# EAGLE design Tetris (EAGLE 6.5.0)
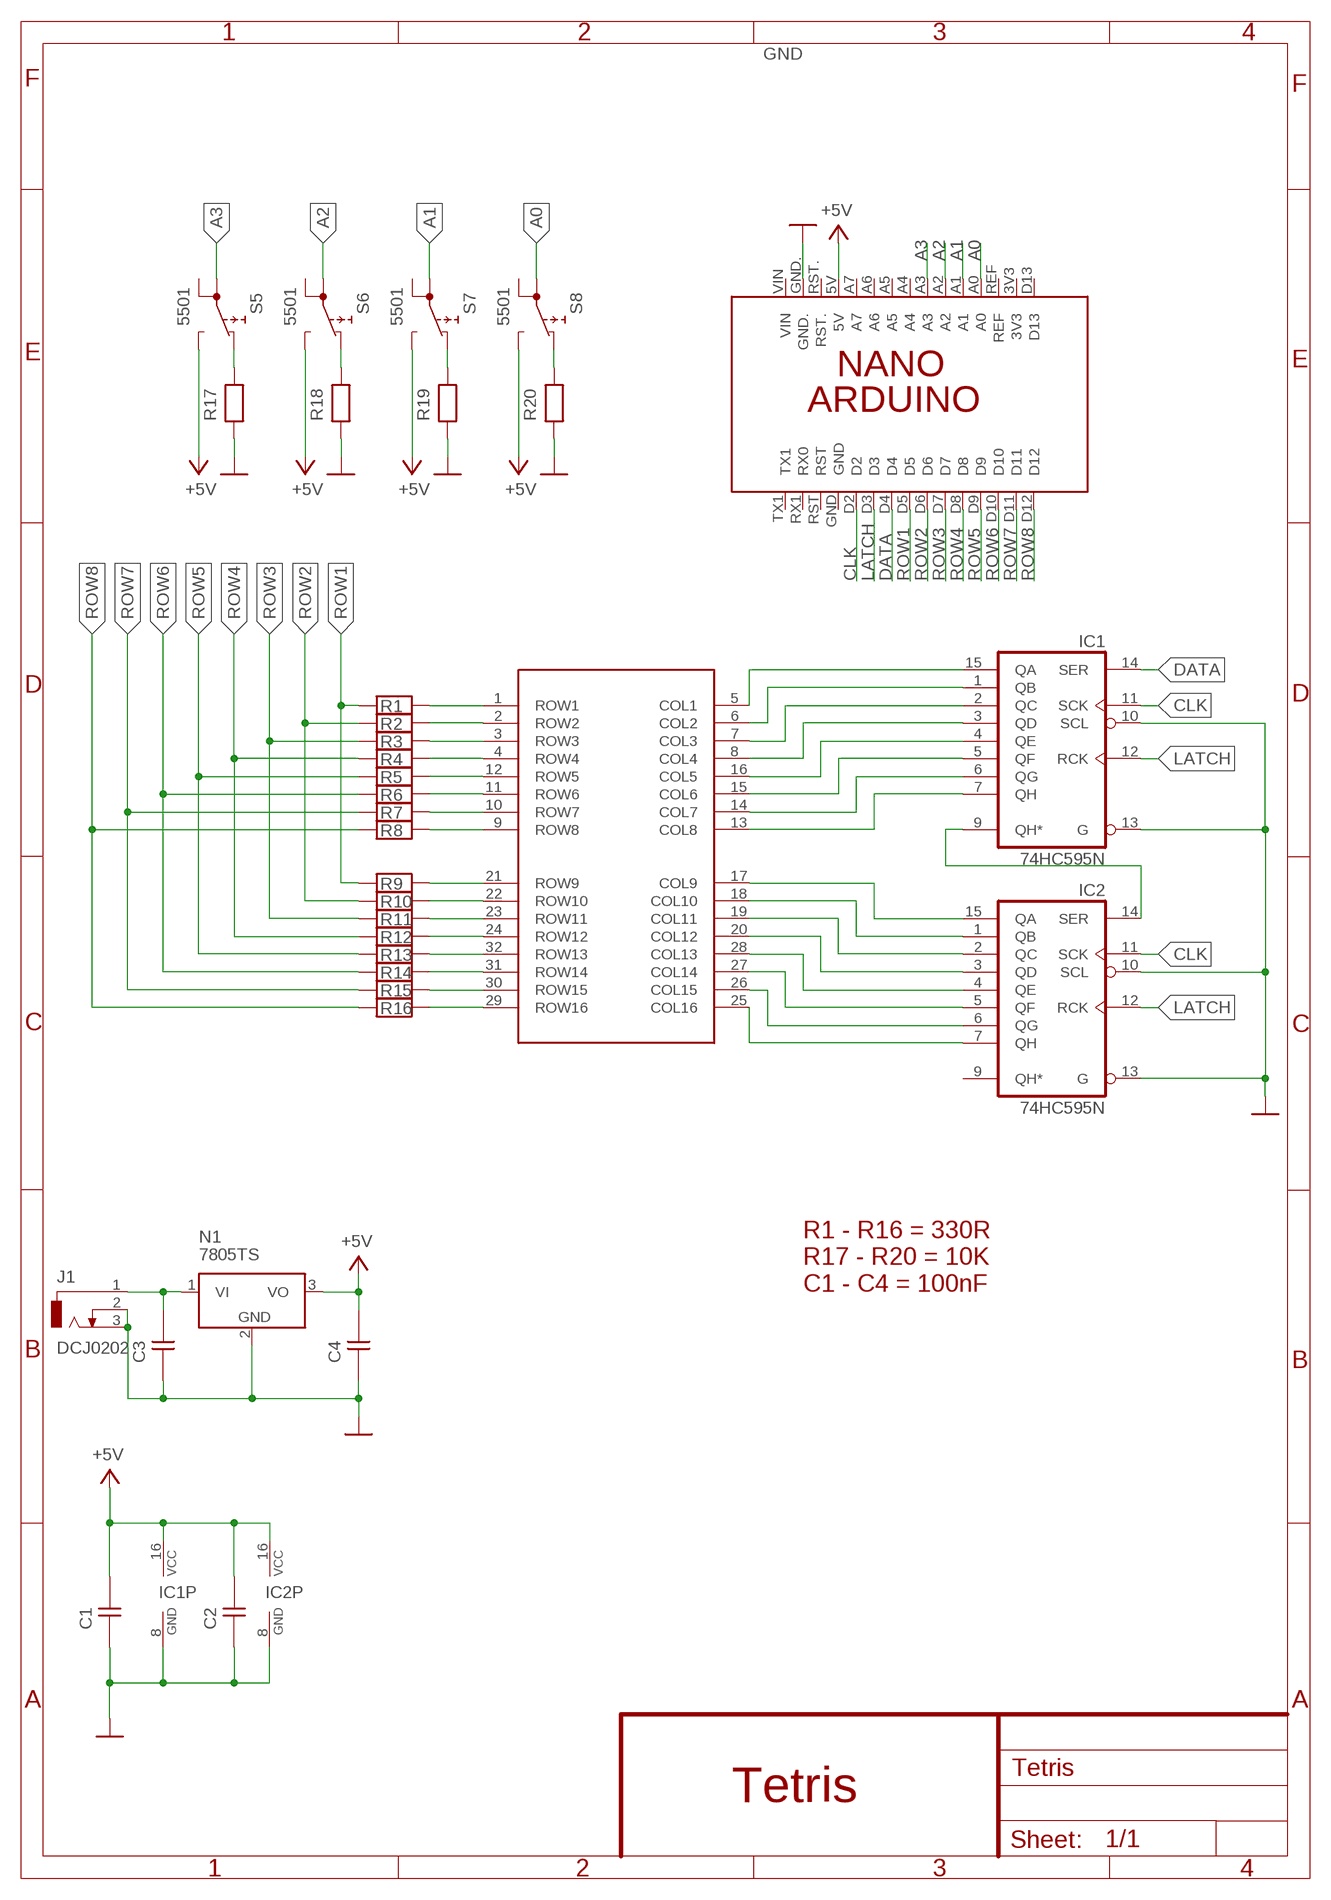
[diagram p0: schematic, sheet 1]

## Parts
C1  C-7.5  [C-7,5]
C2  C-7.5  [C-7,5]
C3  C-7.5  [C-7,5]
C4  C-7.5  [C-7,5]
IC1  74HC595N  [DIL16]
IC2  74HC595N  [DIL16]
J1  DCJ0202  [DCJ0202]
N1  7805TS  [TO-220S]
PCB1  ARDUINO_NANO  [ARDUINO_NANO]
R1  R-10  [R-10]
R2  R-10  [R-10]
R3  R-10  [R-10]
R4  R-10  [R-10]
R5  R-10  [R-10]
R6  R-10  [R-10]
R7  R-10  [R-10]
R8  R-10  [R-10]
R9  R-10  [R-10]
R10  R-10  [R-10]
R11  R-10  [R-10]
R12  R-10  [R-10]
R13  R-10  [R-10]
R14  R-10  [R-10]
R15  R-10  [R-10]
R16  R-10  [R-10]
R17  R-10  [R-10]
R18  R-10  [R-10]
R19  R-10  [R-10]
R20  R-10  [R-10]
S5  5501  [5501]
S6  5501  [5501]
S7  5501  [5501]
S8  5501  [5501]
U$9  DOT_MATRIX  [SH]

## Nets
+5V: C1.2 C2.2 C4.2 IC1.16(VCC) IC2.16(VCC) N1.3(VO) PCB1.5V S5.NC(NO) S6.NC(NO) S7.NC(NO) S8.NC(NO)
A0: PCB1.A0 S8.1A
A1: PCB1.A1 S7.1A
A2: PCB1.A2 S6.1A
A3: PCB1.A3 S5.1A
CLK: IC1.11(SCK) IC2.11(SCK) PCB1.D2
DATA: IC1.14(SER) PCB1.D4
GND: C1.1 C2.1 C3.1 C4.1 IC1.8(GND) IC1.10(SCL) IC1.13(G) IC2.8(GND) IC2.10(SCL) IC2.13(G) J1.2 J1.3 N1.2(GND) PCB1.GND. R17.1 R18.1 R19.1 R20.1
LATCH: IC1.12(RCK) IC2.12(RCK) PCB1.D3
N$1: IC2.15(QA) U$9.17(COL9)
N$2: IC2.1(QB) U$9.18(COL10)
N$3: IC2.2(QC) U$9.19(COL11)
N$4: IC1.9(QH*) IC2.14(SER)
N$5: C3.2 J1.1 N1.1(VI)
N$6: IC2.3(QD) U$9.20(COL12)
N$7: IC2.4(QE) U$9.28(COL13)
N$8: IC2.5(QF) U$9.27(COL14)
N$9: IC2.6(QG) U$9.26(COL15)
N$10: IC2.7(QH) U$9.25(COL16)
N$11: IC1.7(QH) U$9.13(COL8)
N$12: IC1.6(QG) U$9.14(COL7)
N$13: IC1.5(QF) U$9.15(COL6)
N$14: IC1.4(QE) U$9.16(COL5)
N$15: IC1.3(QD) U$9.8(COL4)
N$16: IC1.2(QC) U$9.7(COL3)
N$17: IC1.1(QB) U$9.6(COL2)
N$18: IC1.15(QA) U$9.5(COL1)
N$19: R8.2 U$9.9(ROW8)
N$20: R7.2 U$9.10(ROW7)
N$21: R6.2 U$9.11(ROW6)
N$22: R5.2 U$9.12(ROW5)
N$23: R1.2 U$9.1(ROW1)
N$24: R2.2 U$9.2(ROW2)
N$25: R3.2 U$9.3(ROW3)
N$26: R4.2 U$9.4(ROW4)
N$27: R9.2 U$9.21(ROW9)
N$28: R10.2 U$9.22(ROW10)
N$29: R11.2 U$9.23(ROW11)
N$30: R12.2 U$9.24(ROW12)
N$31: R13.2 U$9.32(ROW13)
N$32: R14.2 U$9.31(ROW14)
N$33: R15.2 U$9.30(ROW15)
N$34: R16.2 U$9.29(ROW16)
N$37: R17.2 S5.NO(NC)
N$38: R18.2 S6.NO(NC)
N$39: R19.2 S7.NO(NC)
N$40: R20.2 S8.NO(NC)
ROW1: PCB1.D5 R1.1 R9.1
ROW2: PCB1.D6 R2.1 R10.1
ROW3: PCB1.D7 R3.1 R11.1
ROW4: PCB1.D8 R4.1 R12.1
ROW5: PCB1.D9 R5.1 R13.1
ROW6: PCB1.D10 R6.1 R14.1
ROW7: PCB1.D11 R7.1 R15.1
ROW8: PCB1.D12 R8.1 R16.1
Unconnected: IC2.9(QH*) PCB1.3V3 PCB1.A4 PCB1.A5 PCB1.A6 PCB1.A7 PCB1.D13 PCB1.GND PCB1.REF PCB1.RST PCB1.RST. PCB1.RX1(RX0) PCB1.TX1 PCB1.VIN S5.1B S6.1B S7.1B S8.1B

## Notes on the sheet
- R1 - R16 = 330R
  R17 - R20 = 10K
  C1 - C4 = 100nF
- Tetris

## Library data of the parts
C1-C4 = rcl:C: CAPACITOR
IC1 IC2 = 74xx-eu:74*595: 8-bit SHIFT REGISTER, output latch
J1 = con-jack:DCJ0202: DC POWER JACK Source: DCJ0202.pdf; OC_FARNELL: unknown; OC_NEWARK: unknown
N1 = linear:78*: Positive VOLTAGE REGULATOR
PCB1 = Arduino:ARDUINO_NANO: Device for representing an Arduino Nano board with a footprint in an EAGLE design. Created by Dave Young for Element14. More EAGLE documentation at: http://www.element14.com/community/community/knode/cadsoft_eagle
R1-R20 = rcl:R: RESISTOR
S5-S8 = switch:55?: PUSHBUTTON SERIES 5500 SWITCHES Source: www.e-switch.com .. 5500.pdf
U$9 = ledMatrix:DOT_MATRIX

## Board
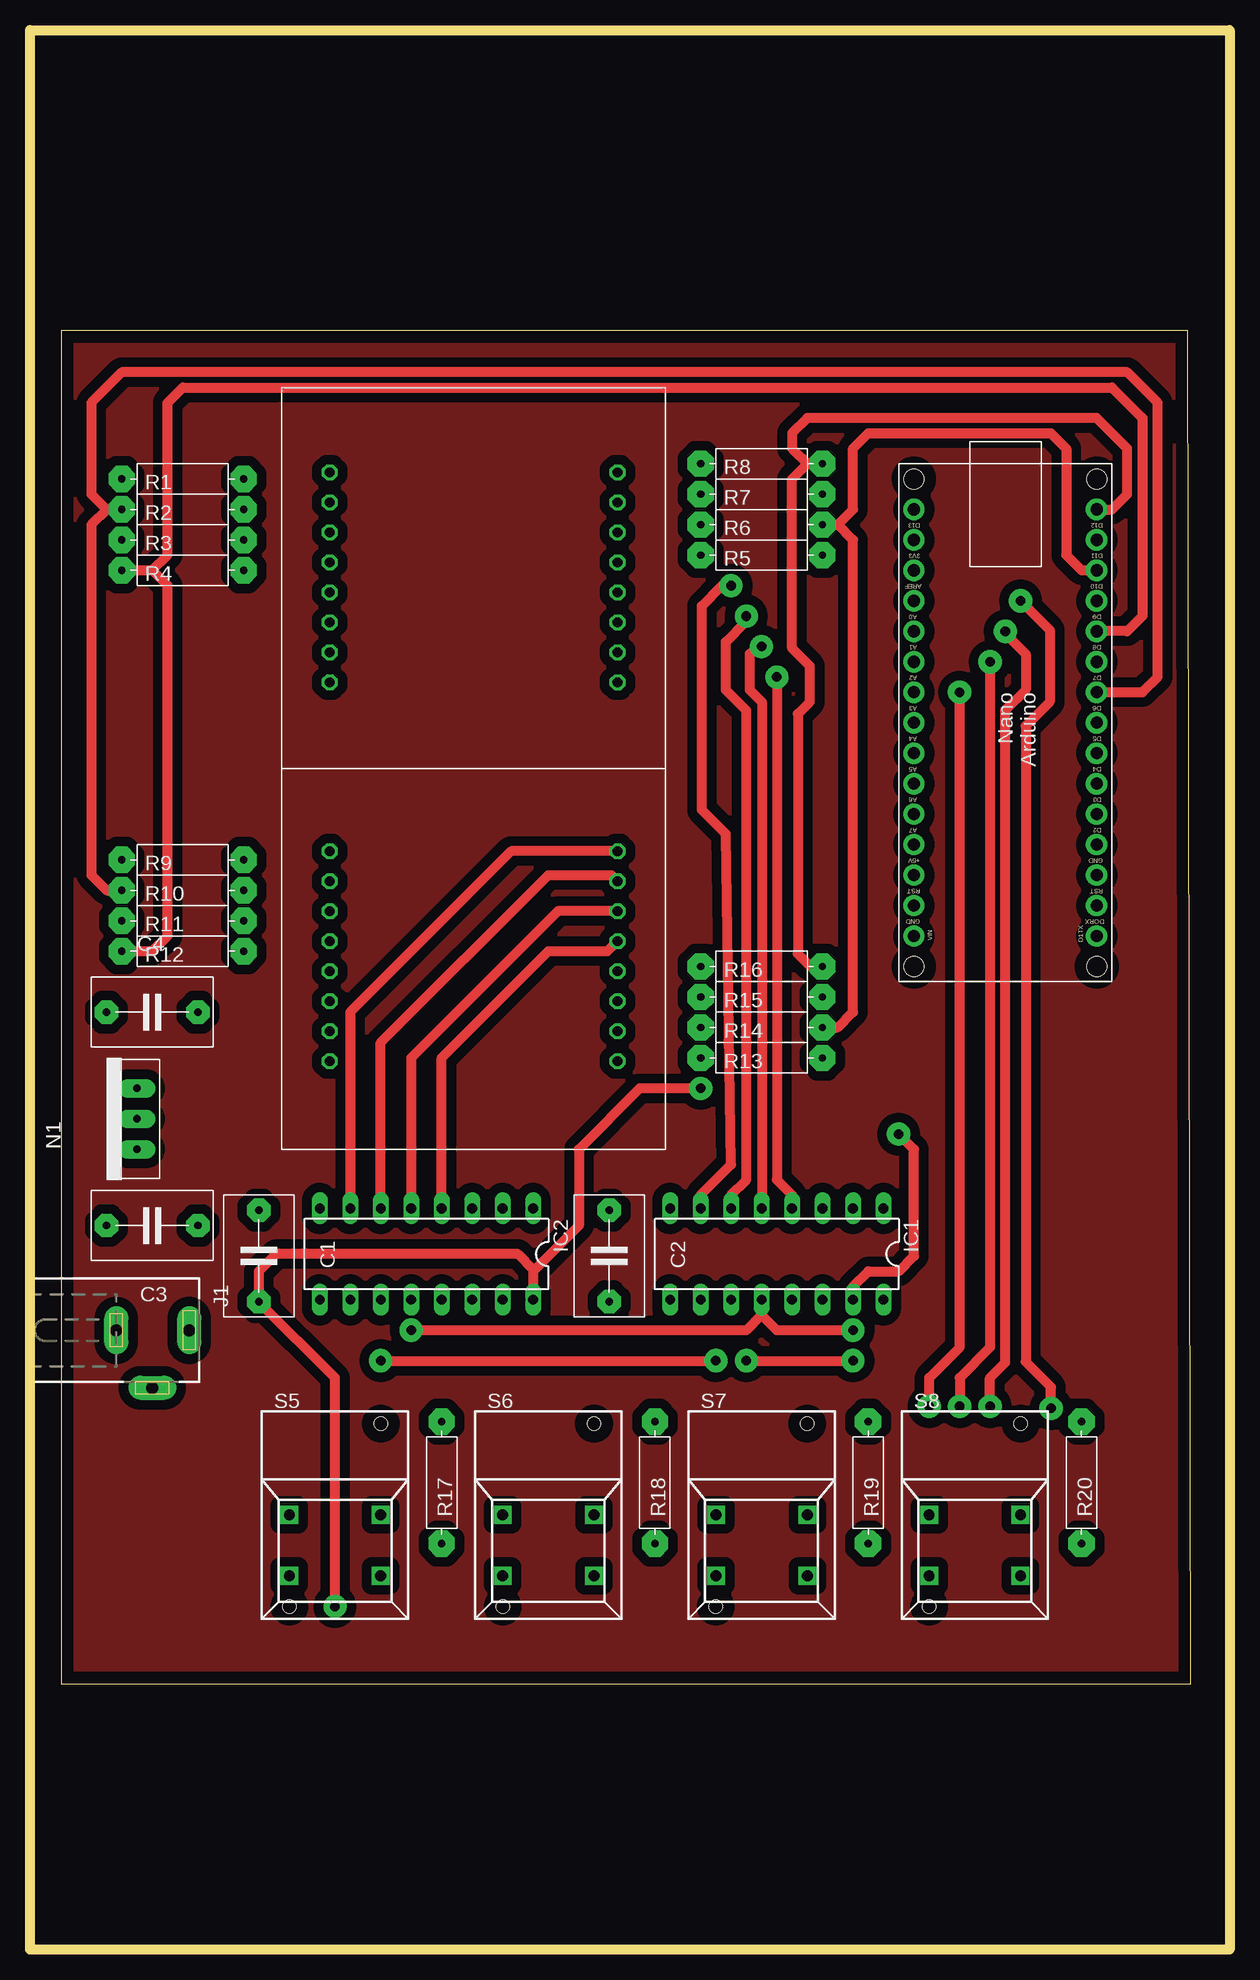
[diagram p1: board, top side]
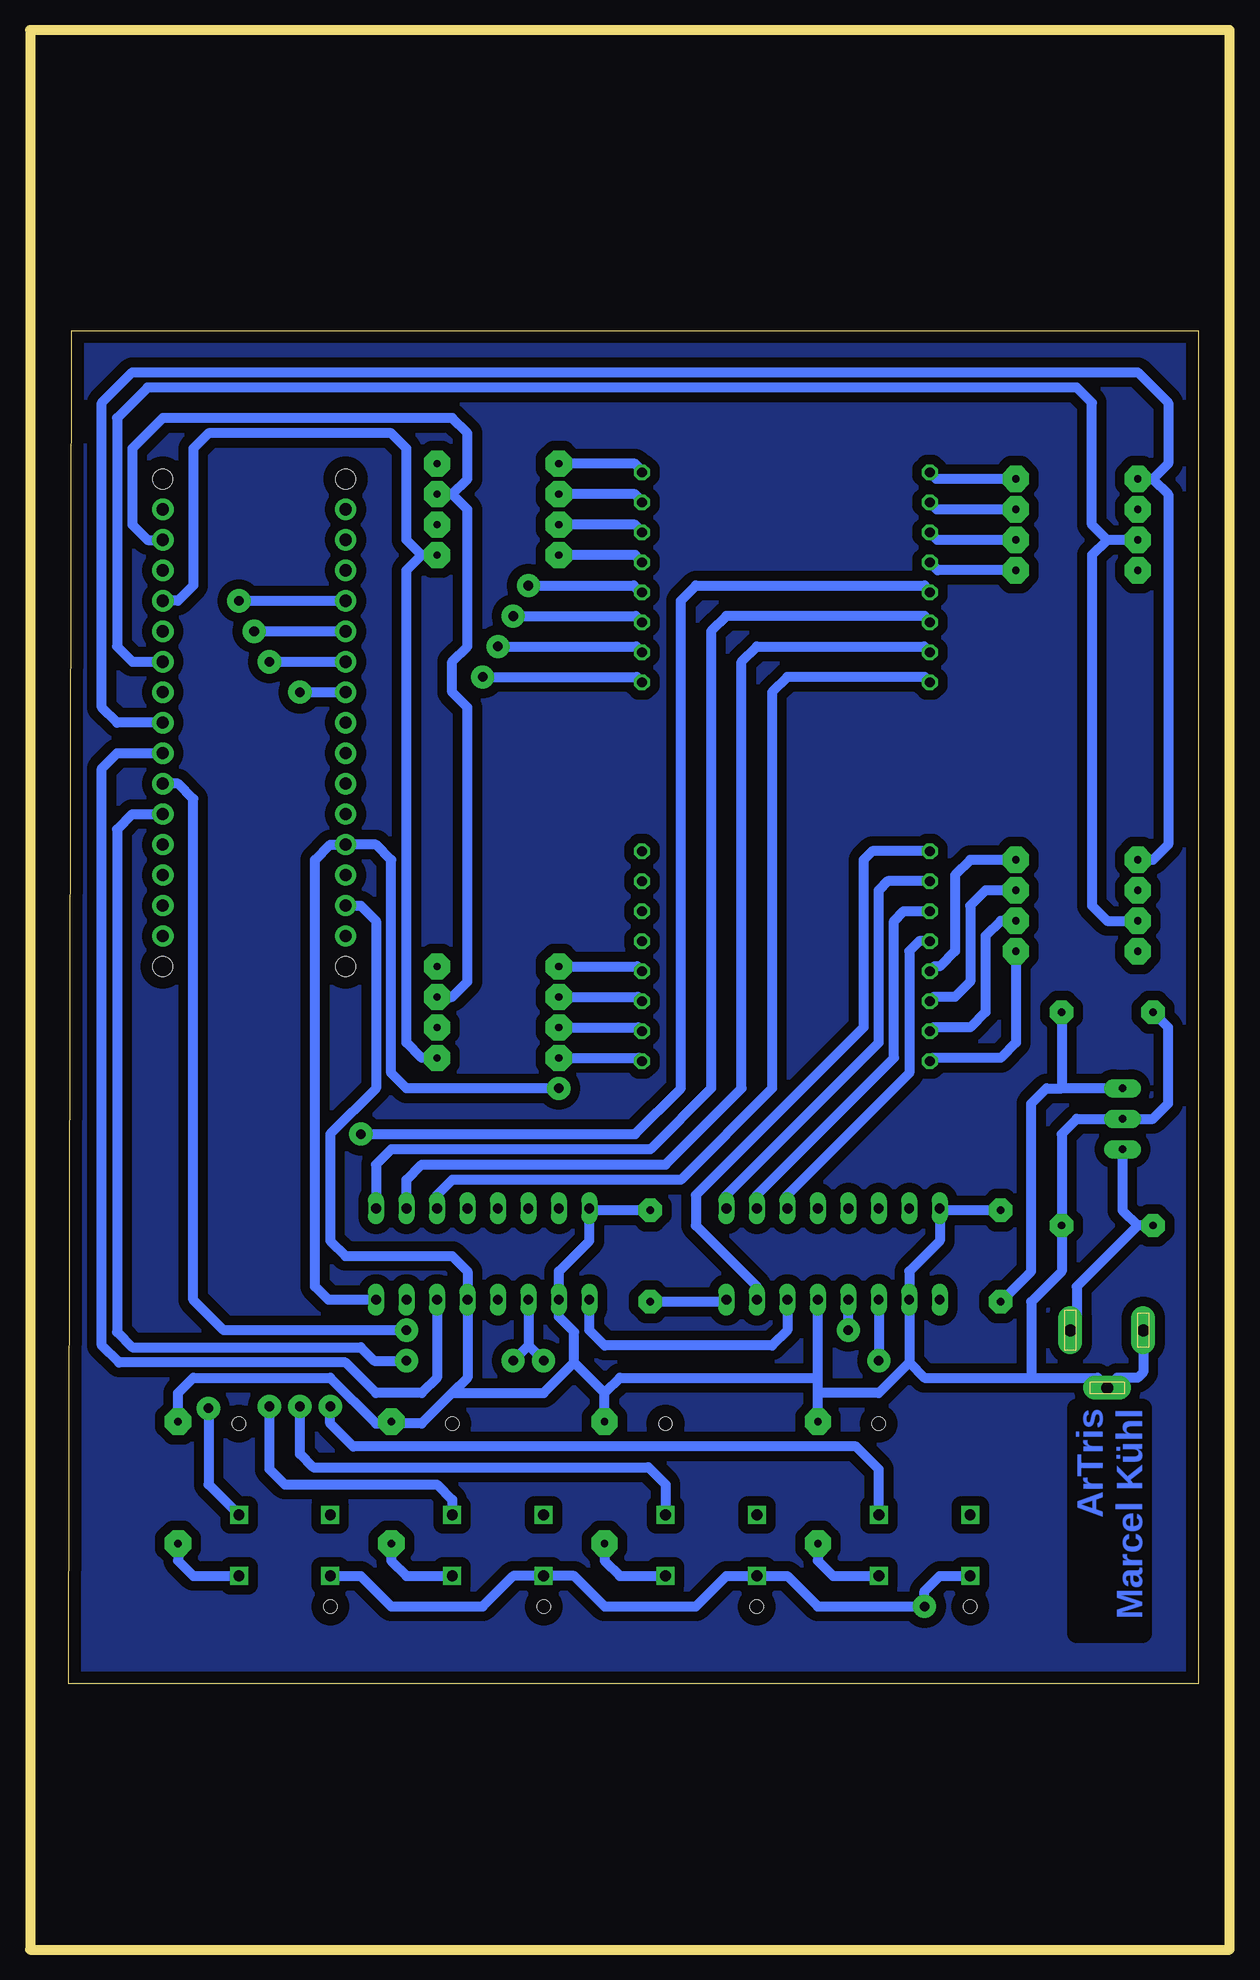
[diagram p2: board, bottom side, seen from below]

Size 100 x 160 mm. Coordinates in mm from the lower left corner, seen from the top.
Outline: 2.61,22.14 96.78,22.14 96.53,134.95 2.62,134.95 2.61,22.14
Outline: 0,0 0,160 100,160 100,0 0,0
Copper layers (1*16): Top 0.035mm / dielectric 1.5mm / Bottom 0.035mm
Design rules "default *": minimum track width 10mil, minimum drill 24mil, track to track 8mil, track to pad 8mil, pad to pad 8mil, via to via 8mil, smd to smd 8mil, copper to edge 40mil, drill to drill 8mil, minimum pad ring 10mil, minimum via ring 8mil, stop-mask expansion 4mil, vias tented up to drill 0mil, thermal gap 10mil

### Footprints (pad centres in the part's own frame; a part is rotated, then mirrored left to right if it is on the bottom)
C-7,5 = drill 0.61 pad 1.93 octagon: 1 -3.81,0; 2 3.81,0
DIL16 = drill 0.813 long: 1 -8.89,-3.81; 2 -6.35,-3.81; 3 -3.81,-3.81; 4 -1.27,-3.81; 5 1.27,-3.81; 6 3.81,-3.81; 7 6.35,-3.81; 8 8.89,-3.81; 9 8.89,3.81; 10 6.35,3.81; 11 3.81,3.81; 12 1.27,3.81; 13 -1.27,3.81; 14 -3.81,3.81; 15 -6.35,3.81; 16 -8.89,3.81
DCJ0202 = drill 1 pad 2 long: 1 0,3.1; 2 4.8,0; 3 0,-3
TO-220S = drill 0.61 pad 1.524 long: 1 -2.54,0; 2 0,0; 3 2.54,0
ARDUINO_NANO = drill 1.016 pad 1.778: 3V3 6.35,1.27; 5V 31.75,1.27; A0 11.43,1.27; A1 13.97,1.27; A2 16.51,1.27; A3 19.05,1.27; A4 21.59,1.27; A5 24.13,1.27; A6 26.67,1.27; A7 29.21,1.27; D2 29.21,16.51; D3 26.67,16.51; D4 24.13,16.51; D5 21.59,16.51; D6 19.05,16.51; D7 16.51,16.51; D8 13.97,16.51; D9 11.43,16.51; D10 8.89,16.51; D11 6.35,16.51; D12 3.81,16.51; D13 3.81,1.27; GND 31.75,16.51; GND. 36.83,1.27; REF 8.89,1.27; RST 34.29,16.51; RST. 34.29,1.27; RX1 36.83,16.51; TX1 39.37,16.51; VIN 39.37,1.27 | hole 1.651: 1.27,1.27; 1.27,16.51; 41.91,16.51; 41.91,1.27
R-10 = drill 0.61 pad 2.184 octagon: 1 -5.08,0; 2 5.08,0
5501 = drill 0.9 pad 1.5 square: 1A 0,3.81; 1B 0,-3.81; NC 5.08,-3.81; NO 5.08,3.81 | hole 1.1: -7.62,3.81; 7.62,-3.81
SH = drill 0.8 octagon: 1 4,-7.07; 2 4,-9.57; 3 4,-12.07; 4 4,-14.57; 5 4,-17.07; 6 4,-19.57; 7 4,-22.07; 8 4,-24.57; 9 28,-7.07; 10 28,-9.57; 11 28,-12.07; 12 28,-14.57; 13 28,-17.07; 14 28,-19.57; 15 28,-22.07; 16 28,-24.57; 17 4,-38.64; 18 4,-41.14; 19 4,-43.64; 20 4,-46.14; 21 4,-48.64; 22 4,-51.14; 23 4,-53.64; 24 4,-56.14; 25 28,-38.64; 26 28,-41.14; 27 28,-43.64; 28 28,-46.14; 29 28,-48.64; 30 28,-51.14; 31 28,-53.64; 32 28,-56.14

### Placement (x,y rotation side)
C1  19.08,57.81 270 top
C2  48.29,57.81 270 top
C3  10.19,60.35 180 top
C4  10.19,78.13 0 top
IC1  62.26,57.97 180 top
IC2  33.05,57.97 180 top
J1  10.19,51.62 270 top
N1  8.92,69.24 90 top
PCB1  72.42,123.85 270 top
R1  12.73,122.58 0 top
R2  12.73,120.04 0 top
R3  12.73,117.5 0 top
R4  12.73,114.96 0 top
R5  60.99,116.23 180 top
R6  60.99,118.77 180 top
R7  60.99,121.31 180 top
R8  60.99,123.85 180 top
R9  12.73,90.83 0 top
R10  12.73,88.29 0 top
R11  12.73,85.75 0 top
R12  12.73,83.21 0 top
R13  60.99,74.32 180 top
R14  60.99,76.86 180 top
R15  60.99,79.4 180 top
R16  60.99,81.94 180 top
R17  34.32,38.92 270 top
R18  52.1,38.92 270 top
R19  69.88,38.92 270 top
R20  87.66,38.92 270 top
S5  25.43,36.22 270 top
S6  43.21,36.22 270 top
S7  60.99,36.22 270 top
S8  78.77,36.22 270 top
U$9  20.98,130.19 0 top

### Tracks (layer width: path | path; a pad name or v marks a point on that pad's centre or on a via)
+5V  (via drill 0.8 pad 1.93)
  Top 0.813: 41.94,56.54 41.94,56.7 40.67,57.97 20.51,57.97 19.08,56.54 C1.2 25.43,47.65 v25.43,28.6 | 41.94,56.54 IC2.16 | v55.91,71.78 50.83,71.78 45.75,66.7 45.75,60.35 41.94,56.54
  Bottom 0.813: IC2.16 41.94,54 C2.2 | IC1.16 75.12,54.16 76.23,55.27 76.23,90.83 74.96,92.1 PCB1.5V 71.15,92.1 69.88,90.83 69.88,73.05 68.61,71.78 v55.91,71.78 | N1.3 14,71.78 | C4.2 14,71.78 | 14,71.78 15.27,71.78 16.54,70.51 16.54,56.54 C1.2 | S8.NC 72.42,31.14 69.88,28.6 62.26,28.6 59.72,31.14 S7.NC 54.64,31.14 52.1,28.6 44.48,28.6 41.94,31.14 S6.NC 36.86,31.14 34.32,28.6 v25.43,28.6 25.43,29.87 24.16,31.14 S5.NC
A0  (via drill 0.8 pad 1.93)
  Top 0.813: v85.12,45.11 85.12,46.88 83,49 83,102 85,104 85,110 v82.58,112.42
  Bottom 0.813: v82.58,112.42 PCB1.A0 | v85.12,45.11 85.12,38.76 S8.1A
A1  (via drill 0.8 pad 1.93)
  Top 0.813: v80.04,45.27 80.04,47.65 81.31,48.92 81.31,103.31 83,105 83,108 81.31,109.69 v81.31,109.88
  Bottom 0.813: v81.31,109.88 PCB1.A1 | v80.04,45.27 80.04,40.03 78.77,38.76 66.07,38.76 64.8,37.49 S7.1A
A2  (via drill 0.8 pad 1.93)
  Top 0.813: v80.04,107.34 80.04,50.19 77.5,47.65 v77.5,45.27
  Bottom 0.813: v80.04,107.34 PCB1.A2 | v77.5,45.27 77.5,41.3 76.39,40.19 48.45,40.19 47.02,38.76 S6.1A
A3  (via drill 0.8 pad 1.93)
  Top 0.813: v74.96,45.27 74.96,47.65 77.5,50.19 v77.5,104.8
  Bottom 0.813: v77.5,104.8 PCB1.A3 | v74.96,45.27 74.96,43.84 73.06,41.94 31.14,41.94 29.24,40.03 S5.1A
CLK  (via drill 0.8 pad 1.93)
  Top 0.813: v29.24,49.08 v57.18,49.08 | v59.72,49.08 v68.61,49.08
  Bottom 0.813: v57.18,49.08 58.45,50.35 | IC2.11 v29.24,49.08 | IC1.11 58.45,50.35 | 58.45,50.35 v59.72,49.08 | v68.61,49.08 71.31,49.08 72.42,50.19 91.47,50.19 92.74,51.46 92.74,93.37 91.47,94.64 PCB1.D2
DATA
  Bottom 0.813: PCB1.D4 92.74,99.72 94.01,98.45 94.01,50.35 92.58,48.92 73.69,48.92 71.15,46.38 67.34,46.38 66.07,47.65 IC1.14
GND
  Bottom 0.813: PCB1.GND. 72.42,87.02 71.15,85.75 71.15,71.78 74.96,67.97 74.96,59.08 73.69,57.81 64.8,57.81 63.53,56.54 IC1.13 63.53,47.65 64.8,46.38 | 34.32,47.65 IC2.13 | 26.7,48.92 IC2.10 26.7,56.54 24.16,59.08 IC2.8 24,61.62 C1.1 | 26.7,48.92 29.24,46.38 34.32,46.38 | 26.7,48.92 25.43,47.65 16.54,47.65 | 16.54,47.65 11.02,47.65 J1.2 9.36,47.65 7.65,47.65 7.19,48.11 J1.3 | 34.32,47.65 50.83,47.65 52.1,46.38 | 54.64,48.92 54.64,51.46 55.91,52.73 IC1.10 55.91,56.54 53.37,59.08 IC1.8 53.21,61.62 C2.1 | 64.8,46.38 57.18,46.38 54.64,48.92 | R20.1 87.66,46.38 86.39,47.65 74.96,47.65 71.15,43.84 69.88,43.84 | 16.54,47.65 16.54,54 14,56.54 C3.1 14,67.97 12.73,69.24 N1.2 6.38,69.24 5.11,70.51 5.11,76.86 C4.1 | R17.1 34.32,46.38 | 34.32,46.38 34.32,47.65 | R18.1 52.1,46.38 | 52.1,46.38 54.64,48.92 | 64.8,46.38 67.34,43.84 69.88,43.84 | 69.88,43.84 R19.1
LATCH  (via drill 0.8 pad 1.93)
  Top 0.813: v68.61,51.62 62.26,51.62 60.99,52.89 | IC1.12 60.99,52.89 | 60.99,52.89 59.72,51.62 v31.78,51.62
  Bottom 0.813: v31.78,51.62 IC2.12 | v68.61,51.62 83.85,51.62 86.39,54.16 86.39,95.91 87.66,97.18 PCB1.D3
N$1
  Bottom 0.813: U$9.17 29.79,91.55 30.51,90.83 30.51,76.86 44.48,62.89 44.48,60.35 39.4,55.27 IC2.15
N$2
  Bottom 0.813: IC2.1 41.94,62.89 29.24,75.59 29.24,88.29 28.48,89.05 U$9.18
N$3
  Bottom 0.813: IC2.2 39.4,62.89 27.97,74.32 27.97,85.75 27.17,86.55 U$9.19
N$4
  Bottom 0.813: IC2.14 36.86,51.62 38.13,50.35 52.1,50.35 53.37,51.62 IC1.9
N$5
  Bottom 0.813: J1.1 12.73,52.18 12.73,55.27 7.65,60.35 | N1.1 8.92,61.62 7.65,60.35 | C3.2 7.65,60.35
N$6
  Bottom 0.813: U$9.20 25.86,84.05 26.7,83.21 26.7,73.05 36.86,62.89 IC2.3
N$7
  Top 0.813: IC2.4 34.32,74.32 43.21,83.21 48.14,83.21 U$9.28
N$8
  Top 0.813: U$9.27 44.01,86.55 31.78,74.32 IC2.5
N$9
  Top 0.813: IC2.6 29.24,75.59 43.21,89.56 48.47,89.56 U$9.26
N$10
  Top 0.813: U$9.25 40.12,91.55 26.7,78.13 IC2.7
N$11  (via drill 0.8 pad 1.93)
  Top 0.813: IC1.7 55.91,62.89 58.45,65.43 58,93 56,95 56,112 57.69,113.69 v58.45,113.69
  Bottom 0.813: v58.45,113.69 49.68,113.69 49.11,113.12 U$9.13
N$12  (via drill 0.8 pad 1.93)
  Top 0.813: IC1.6 58.45,62.89 59.72,64.16 59.72,103.28 58,105 58,109 59.72,110.72 v59.72,111.15
  Bottom 0.813: v59.72,111.15 49.51,111.15 U$9.14
N$13  (via drill 0.8 pad 1.93)
  Top 0.813: v60.99,108.61 60.61,108.61 60,108 60,105 61,104 IC1.5
  Bottom 0.813: v60.99,108.61 49.47,108.61 U$9.15
N$14  (via drill 0.8 pad 1.93)
  Top 0.813: IC1.4 63.53,62.89 62.26,64.16 v62.26,106.07
  Bottom 0.813: v62.26,106.07 49.43,106.07 U$9.16
N$15
  Bottom 0.813: U$9.8 25.43,106.07 36.86,106.07 38.13,104.8 38.13,71.78 45.75,64.16 64.8,64.16 66.07,62.89 IC1.3
N$16
  Bottom 0.813: IC1.2 68.61,64.16 67.34,65.43 47.02,65.43 40.67,71.78 40.67,107.34 39.4,108.61 25.47,108.61 U$9.7
N$17
  Bottom 0.813: U$9.6 24.98,110.7 25.43,111.15 41.94,111.15 43.21,109.88 43.21,71.78 48.29,66.7 69.88,66.7 71.15,65.43 IC1.1
N$18  (via drill 0.8 pad 1.93)
  Top 0.813: IC1.15 68.61,55.27 69.88,56.54 72.42,56.54 73.69,57.81 73.69,66.7 v72.42,67.97
  Bottom 0.813: v72.42,67.97 49.56,67.97 45.75,71.78 45.75,112.42 44.48,113.69 25.43,113.69 24.98,113.24 U$9.5
N$19
  Bottom 0.813: U$9.9 48.98,123.27 49.56,123.85 R8.2
N$20
  Bottom 0.813: U$9.10 48.98,120.73 49.56,121.31 R7.2
N$21
  Bottom 0.813: U$9.11 48.98,118.19 49.56,118.77 R6.2
N$22
  Bottom 0.813: U$9.12 48.98,115.65 49.56,116.23 R5.2
N$23
  Bottom 0.813: R1.2 24.44,122.58 U$9.1
N$24
  Bottom 0.813: R2.2 24.4,120.04 U$9.2
N$25
  Bottom 0.813: R3.2 24.36,117.5 U$9.3
N$26
  Bottom 0.813: R4.2 24.32,114.96 U$9.4
N$27
  Bottom 0.813: R9.2 21.62,90.83 22.89,89.56 22.89,83.21 24.16,81.94 24.59,81.94 U$9.21
N$28
  Bottom 0.813: R10.2 20.35,88.29 21.62,87.02 21.62,80.67 22.89,79.4 24.63,79.4 U$9.22
N$29
  Bottom 0.813: R11.2 19.08,85.75 20.35,84.48 20.35,78.13 21.62,76.86 24.67,76.86 U$9.23
N$30
  Bottom 0.813: R12.2 17.81,75.59 19.08,74.32 24.71,74.32 U$9.24
N$31
  Bottom 0.813: R13.2 49.25,74.32 U$9.32
N$32
  Bottom 0.813: R14.2 49.29,76.86 U$9.31
N$33
  Bottom 0.813: R15.2 49.33,79.4 U$9.30
N$34
  Bottom 0.813: R16.2 49.37,81.94 U$9.29
N$35
  pour Top (isolate 0.813): 2.57,135.28 2.57,22.25 96.55,22.25 96.55,135.28
N$36
  pour Bottom (isolate 0.813): 2.57,135.28 96.55,135.28 96.55,22.25 2.57,22.25
N$37
  Bottom 0.813: R17.2 34.32,32.41 33.05,31.14 S5.NO
N$38
  Bottom 0.813: R18.2 52.1,32.41 50.83,31.14 S6.NO
N$39
  Bottom 0.813: R19.2 69.88,32.41 68.61,31.14 S7.NO
N$40
  Bottom 0.813: R20.2 87.66,32.41 86.39,31.14 S8.NO
ROW1
  Bottom 0.813: PCB1.D5 92.74,102.26 94.01,103.53 94.01,128.93 91.47,131.47 7.65,131.47 5.11,128.93 5.11,123.85 6.38,122.58 | R1.1 6.38,122.58 | 6.38,122.58 5.11,121.31 5.11,92.1 6.38,90.83 R9.1
ROW2
  Top 0.813: PCB1.D6 92.74,104.8 94.01,106.07 94.01,128.93 91.47,131.47 7.65,131.47 5.11,128.93 5.11,121.31 6.38,120.04 | R2.1 6.38,120.04 | 6.38,120.04 5.11,118.77 5.11,89.56 6.38,88.29 R10.1
ROW3
  Bottom 0.813: R3.1 10.19,117.5 | R11.1 10.19,85.75 11.46,87.02 11.46,116.23 10.19,117.5 | 10.19,117.5 11.46,118.77 11.46,128.93 12.73,130.2 90.2,130.2 92.74,127.66 92.74,108.61 91.47,107.34 PCB1.D7
ROW4
  Top 0.813: R12.1 10.19,83.21 11.46,84.48 11.46,113.69 10.19,114.96 | R4.1 10.19,114.96 | 10.19,114.96 11.46,116.23 11.46,128.93 12.73,130.2 90.2,130.2 92.74,127.66 92.74,111.15 91.47,109.88 PCB1.D8
ROW5
  Bottom 0.813: R13.1 67.34,74.32 68.61,75.59 68.61,114.96 67.34,116.23 | R5.1 67.34,116.23 | 67.34,116.23 68.61,117.5 68.61,125.12 69.88,126.39 85.12,126.39 86.39,125.12 86.39,113.69 87.66,112.42 PCB1.D9
ROW6
  Top 0.813: R14.1 67.34,76.86 68.61,78.13 68.61,117.5 67.34,118.77 | R6.1 67.34,118.77 | 67.34,118.77 68.61,120.04 68.61,125.12 69.88,126.39 85.12,126.39 86.39,125.12 86.39,116.23 87.66,114.96 PCB1.D10
ROW7
  Bottom 0.813: R15.1 64.8,79.4 63.53,80.67 63.53,103.53 64.8,104.8 64.8,107.34 63.53,108.61 63.53,120.04 64.8,121.31 | R7.1 64.8,121.31 | 64.8,121.31 63.53,122.58 63.53,126.39 64.8,127.66 88.93,127.66 91.47,125.12 91.47,118.77 90.2,117.5 PCB1.D11
ROW8
  Top 0.813: 64.8,123.85 63.53,122.58 63.53,108.47 65,107 65,104 64,103 64,83 65,82 66.01,82 R16.1 | 64.8,123.85 R8.1 | PCB1.D12 90.2,120.04 91.47,121.31 91.47,125.12 88.93,127.66 64.8,127.66 63.53,126.39 63.53,125.12 64.8,123.85

### Text on the board
Bottom: ArTris / Marcel Kühl